# EAGLE design merope-relays (EAGLE 6.5.0)
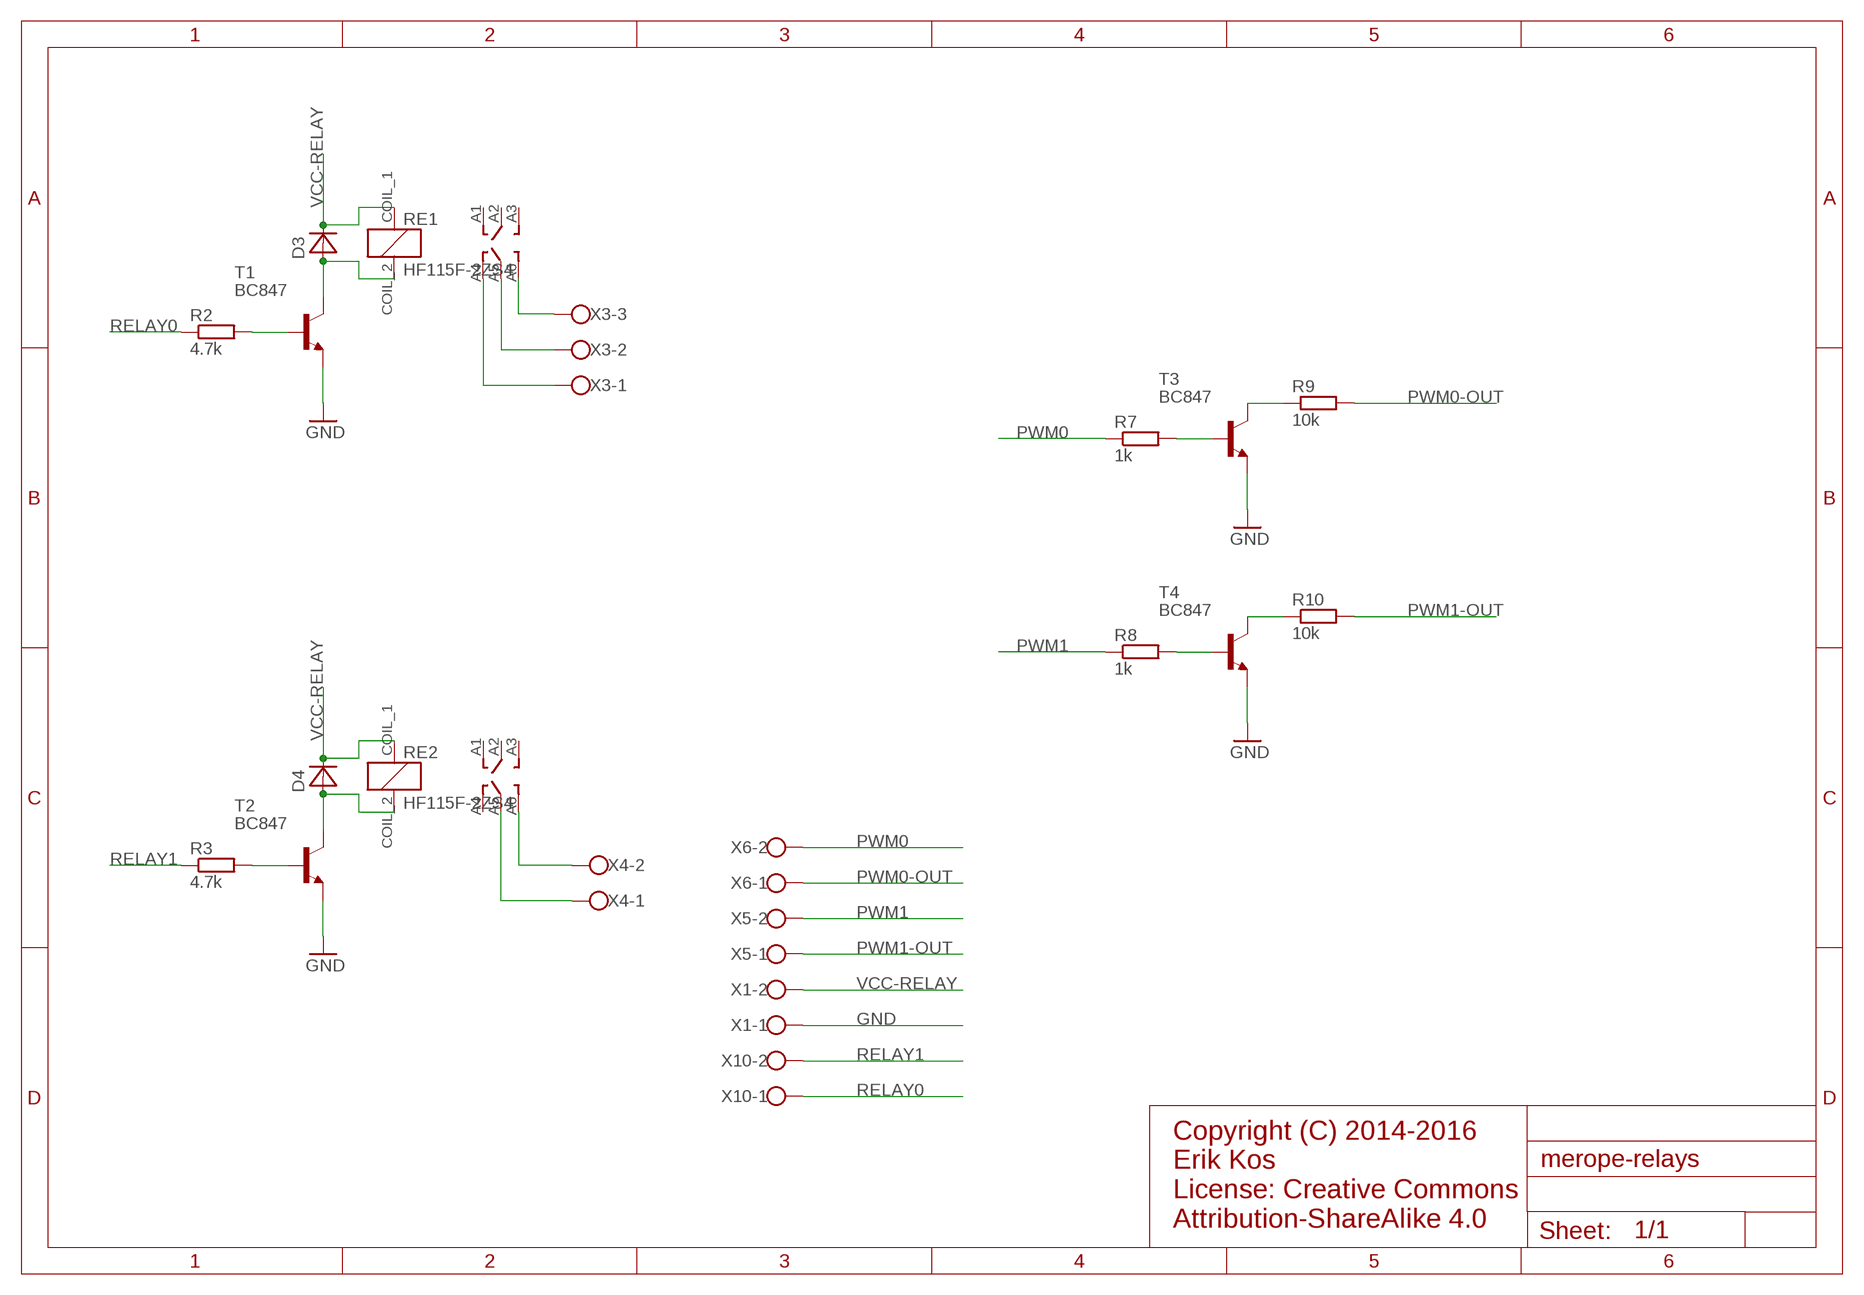
[diagram p0: schematic, sheet 1]

## Parts
D3  DIODE_0805  [R0805]
D4  DIODE_0805  [R0805]
R2  4.7k  R-EU_M0805  [M0805]
R3  4.7k  R-EU_M0805  [M0805]
R7  1k  R-EU_M0805  [M0805]
R8  1k  R-EU_M0805  [M0805]
R9  10k  R-EU_M0805  [M0805]
R10  10k  R-EU_M0805  [M0805]
RE1  HF115F-2ZS4  [HF115F]
RE2  HF115F-2ZS4  [HF115F]
T1  BC847  BC817-25-NPN-SOT23-BEC  [SOT23-BEC]
T2  BC847  BC817-25-NPN-SOT23-BEC  [SOT23-BEC]
T3  BC847  BC817-25-NPN-SOT23-BEC  [SOT23-BEC]
T4  BC847  BC817-25-NPN-SOT23-BEC  [SOT23-BEC]
X1  TERMINAL_BLOCK_35_2  [TERMINAL_BLOCK_35_2]
X3  TERMINAL_BLOCK_5_3  [TERMINAL_BLOCK_5_3]
X4  TERMINAL_BLOCK_5_2  [TERMINAL_BLOCK_5_2]
X5  TERMINAL_BLOCK_35_2  [TERMINAL_BLOCK_35_2]
X6  TERMINAL_BLOCK_35_2  [TERMINAL_BLOCK_35_2]
X10  TERMINAL_BLOCK_35_2  [TERMINAL_BLOCK_35_2]

## Nets
GND [16mils]: T1.E T2.E T3.E T4.E X1.1
N$1: RE2.A6 X4.2
N$2: R2.2 T1.B
N$3: RE1.A6 X3.3
N$4: RE1.A5 X3.2
N$5: D3.1(A) RE1.COIL_2 T1.C
N$6: RE2.A5 X4.1
N$7: RE1.A4 X3.1
N$8: R3.2 T2.B
N$9: D4.1(A) RE2.COIL_2 T2.C
N$22: R7.2 T3.B
N$26: R9.1 T3.C
N$27: R8.2 T4.B
N$28: R10.1 T4.C
PWM0: R7.1 X6.2
PWM0-OUT: R9.2 X6.1
PWM1: R8.1 X5.2
PWM1-OUT: R10.2 X5.1
RELAY0: R2.1 X10.1
RELAY1: R3.1 X10.2
VCC-RELAY [16mils]: D3.2(C) D4.2(C) RE1.COIL_1 RE2.COIL_1 X1.2
Unconnected: RE1.A1 RE1.A2 RE1.A3 RE2.A1 RE2.A2 RE2.A3 RE2.A4

## Notes on the sheet
- Copyright (C) 2014-2016
  Erik Kos
  License: Creative Commons 
  Attribution-ShareAlike 4.0

## Library data of the parts
D3 D4 = js:DIODE_0805
R2 R3 R7-R10 = rcl:R-EU_: RESISTOR, European symbol
RE1 RE2 = js:HF115F-2ZS4
T1-T4 = transistor:*-NPN-: NPN Transistror BF959 corrected 2008.03.06
X1 X5 X6 X10 = js:TERMINAL_BLOCK_35_2
X3 = js:TERMINAL_BLOCK_5_3
X4 = js:TERMINAL_BLOCK_5_2

## Net classes
2 16mils: width 0.406 mm

## Board
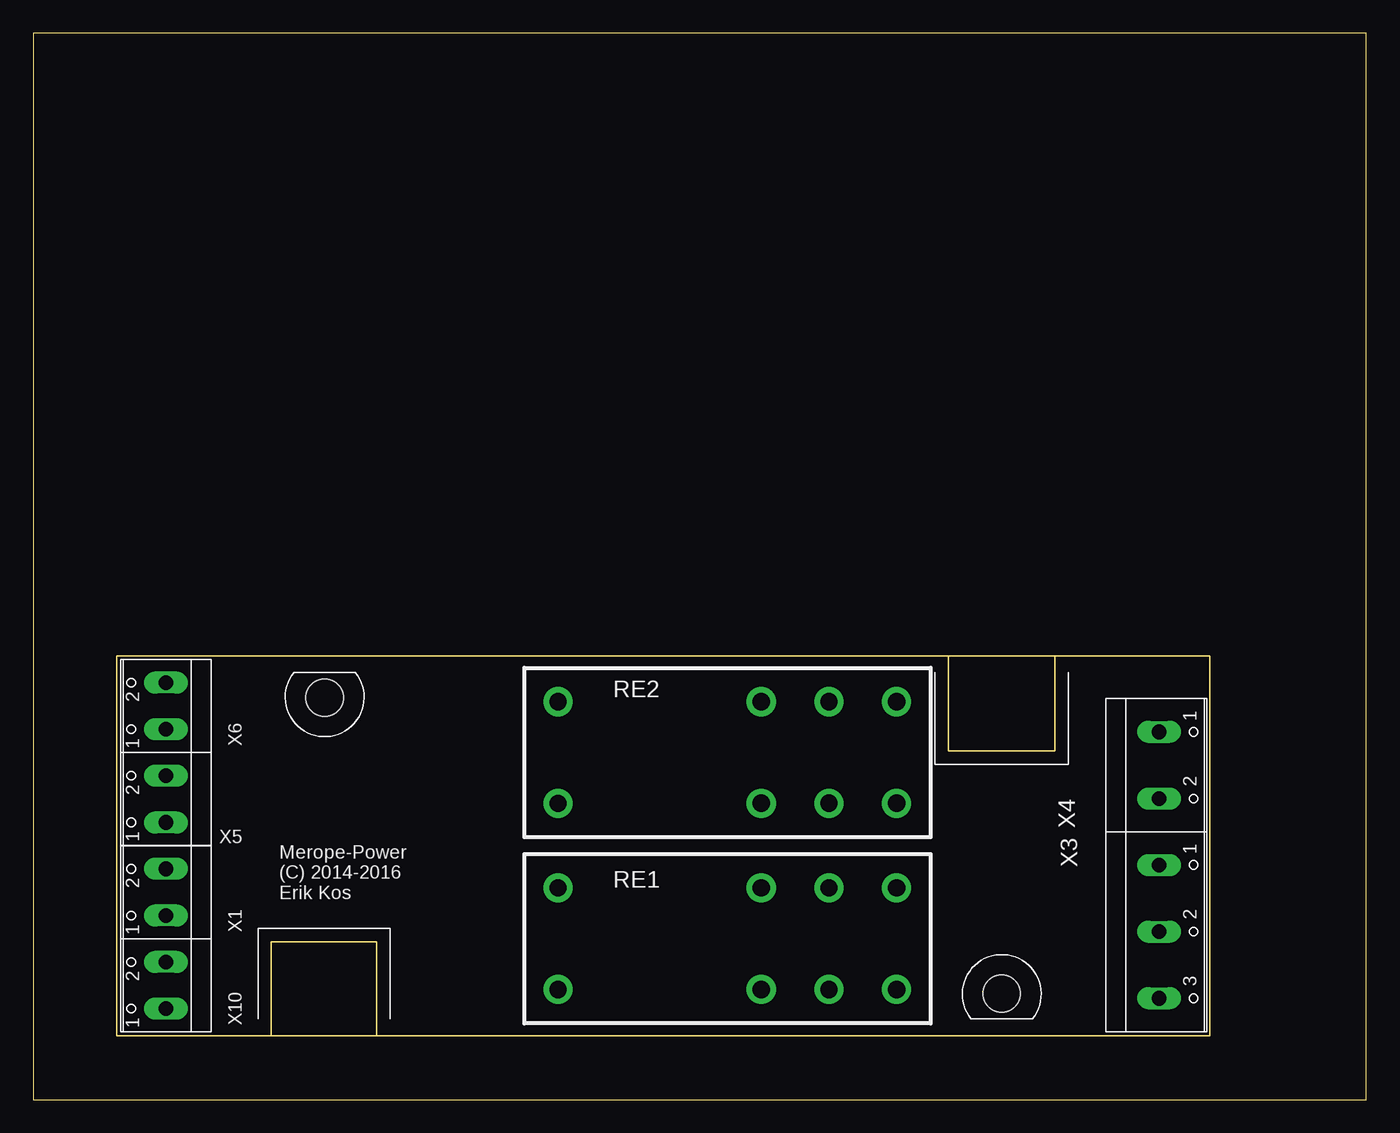
[diagram p1: board, top side]
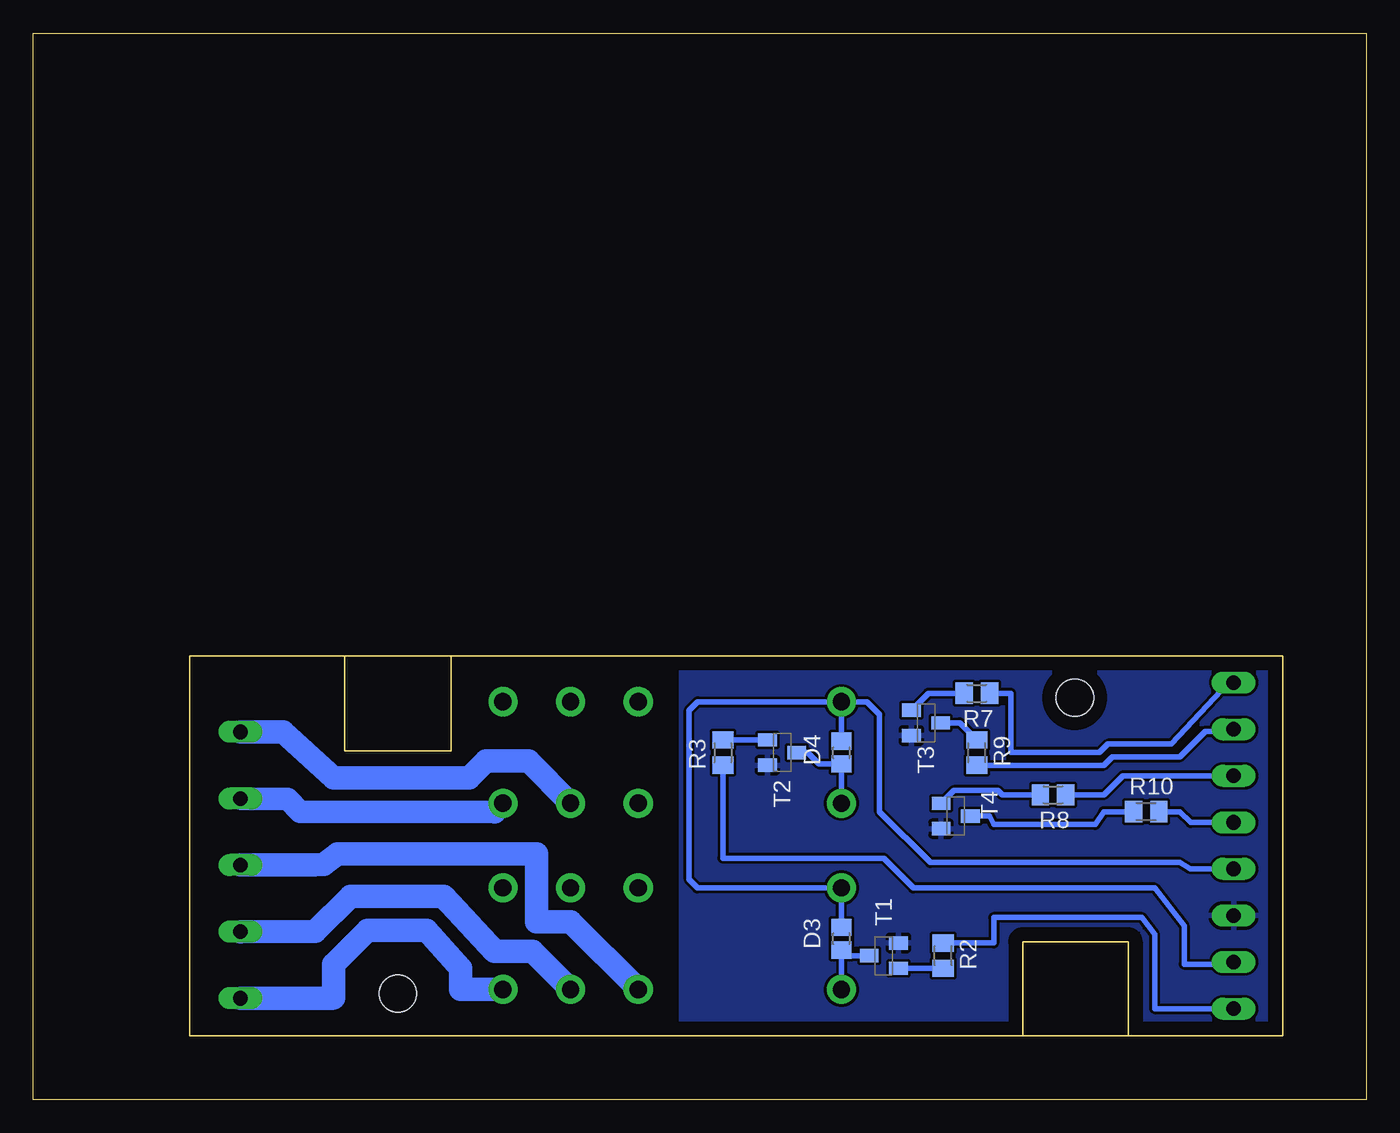
[diagram p2: board, bottom side, seen from below]

Size 100 x 80 mm. Coordinates in mm from the lower left corner, seen from the top.
Outline: 0,0 100,0 100,80 0,80 0,0
Copper layers (1*16): Top 0.035mm / dielectric 1.5mm / Bottom 0.035mm
Design rules "default": minimum track width 10mil, minimum drill 24mil, track to track 8mil, track to pad 8mil, pad to pad 8mil, via to via 8mil, smd to smd 8mil, copper to edge 40mil, drill to drill 8mil, minimum pad ring 10mil, minimum via ring 8mil, stop-mask expansion 4mil, vias tented up to drill 0mil, thermal gap 10mil

### Footprints (pad centres in the part's own frame; a part is rotated, then mirrored left to right if it is on the bottom)
R0805 = smd 1.3 x 1.5: 1 -0.85,0; 2 0.85,0
M0805 = smd 1.3 x 1.6: 1 -0.95,0; 2 0.95,0
HF115F = drill 1.3 pad 2.184: A1 5.08,5.086; A2 10.16,5.086; A3 15.24,5.086; A4 5.08,-2.534; A5 10.16,-2.534; A6 15.24,-2.534; COIL_1 -10.16,5.086; COIL_2 -10.162,-2.54
SOT23-BEC = smd 1 x 1.4: B -0.95,-1.1; C 0,1.1; E 0.95,-1.1
Z-103 = hole 2.8: -26.4,11.1; 24.4,-11.1
TERMINAL_BLOCK_35_2 = drill 1.1 long: 1 -1.75,-0.1; 2 1.75,-0.1
TERMINAL_BLOCK_5_3 = drill 1.1 long: 1 -4.9,0; 2 0.1,0; 3 5.1,0
TERMINAL_BLOCK_5_2 = drill 1.1 long: 1 -2.5,0; 2 2.5,0

### Placement (x,y rotation side)
D3  39.37,12.06 90 bottom
D4  39.37,26.04 90 bottom
R2  31.75,10.79 270 bottom
R3  48.26,26.04 90 bottom
R7  29.21,30.48 180 bottom
R8  23.5,22.86 180 bottom
R9  29.21,26.04 270 bottom
R10  16.51,21.59 0 bottom
RE1  49.53,10.79 0 top
RE2  49.53,24.77 0 top
T1  36.2,10.79 90 bottom
T2  43.81,26.04 270 bottom
T3  33.02,28.26 270 bottom
T4  30.8,21.27 270 bottom
U$1  [Z-103]  48.26,19.05 0 top
X1  9.84,15.56 90 top
X3  84.45,12.7 270 top
X4  84.45,25.08 270 top
X5  9.84,22.54 90 top
X6  9.84,29.53 90 top
X10  9.84,8.57 90 top

### Tracks (layer width: path | path; a pad name or v marks a point on that pad's centre or on a via)
GND
  pour Bottom: 6.7,33.12 51.37,33.21 51.37,5.18 6.6,5.08 6.6,32.96
N$1
  Bottom 1.676: 65.41,21.59 79.98,21.59 80.93,22.54 84.42,22.54 X4.2
  Bottom 1.778: 65.41,21.59 RE2.A6
N$2
  Bottom 0.406: R2.2 T1.B
N$3
  Bottom 1.016: 77.58,7.61 77.47,7.62 | RE1.A6
  Bottom 1.778: X3.3 77.58,7.61 | 77.47,7.62 77.47,10.16 74.93,12.7 70.48,12.7 67.94,9.84 67.94,8.26 RE1.A6
N$4
  Bottom 1.778: X3.2 78.87,12.61 76.2,15.24 69.22,15.24 65.41,11.11 62.54,11.11 RE1.A5
N$5
  Bottom 0.406: D3.1 RE1.COIL_2 | D3.1 39.59,11.43 | T1.C 38.95,10.79 D3.1
N$6
  Bottom 1.778: X4.1 81.24,27.58 77.47,24.13 67.31,24.13 66.04,25.4 62.86,25.4 RE2.A5
N$7
  Bottom 1.778: RE1.A4 59.68,13.34 62.23,13.34 62.23,18.41 77.15,18.41 78.23,17.65 78.89,17.59 X3.1
N$8
  Bottom 0.406: R3.2 48.26,26.67 47.95,26.98 T2.B
N$9
  Bottom 0.406: RE2.COIL_2 D4.1 41.06,25.18 41.91,26.04 T2.C
N$22
  Bottom 0.406: T3.B 32.85,30.48 R7.2
N$26
  Bottom 0.406: T3.C 30.48,28.26 R9.1
N$27
  Bottom 0.406: 31.43,22.22 T4.B 30.94,23.18 27.62,23.18 27.3,22.86 R8.2
N$28
  Bottom 0.406: R10.1 19.68,21.59 20.32,20.64 27.94,20.64 28.26,21.27 T4.C
PWM0
  Bottom 0.406: X6.2 10.31,31.28 14.61,26.67 19.37,26.67 20,26.04 26.67,26.04 26.67,30.48 R7.1 28.26,30.16
PWM0-OUT
  Bottom 0.406: X6.1 9.78,27.62 12.06,27.62 13.97,25.72 19.05,25.72 19.68,25.08 R9.2
PWM1
  Bottom 0.406: X5.2 18.25,24.29 19.68,22.86 R8.1
PWM1-OUT
  Bottom 0.406: X5.1 13.17,20.79 13.97,21.59 R10.2
RELAY0
  Bottom 0.406: R2.1 27.94,11.75 27.94,13.65 16.83,13.65 15.88,12.38 15.88,6.82 X10.1
RELAY1
  Bottom 0.406: R3.1 48.26,18.1 36.2,18.1 33.97,15.88 15.88,15.88 13.65,13.02 13.65,10.16 9.79,10.16 X10.2
VCC-RELAY
  Bottom 0.406: D3.2 RE1.COIL_1 50.17,15.88 50.8,16.51 50.8,29.21 50.16,29.84 RE2.COIL_1 | D4.2 RE2.COIL_1 | X1.2 13.18,17.31 13.97,17.78 32.7,17.78 36.51,21.59 36.51,28.89 37.47,29.84 RE2.COIL_1

### Text on the board
tNames: Merope-Power / (C) 2014-2016 / Erik Kos